# Altium schematic sheet 10 MCU_LINK_DEBUG.SchDoc
size 513 x 386 mm
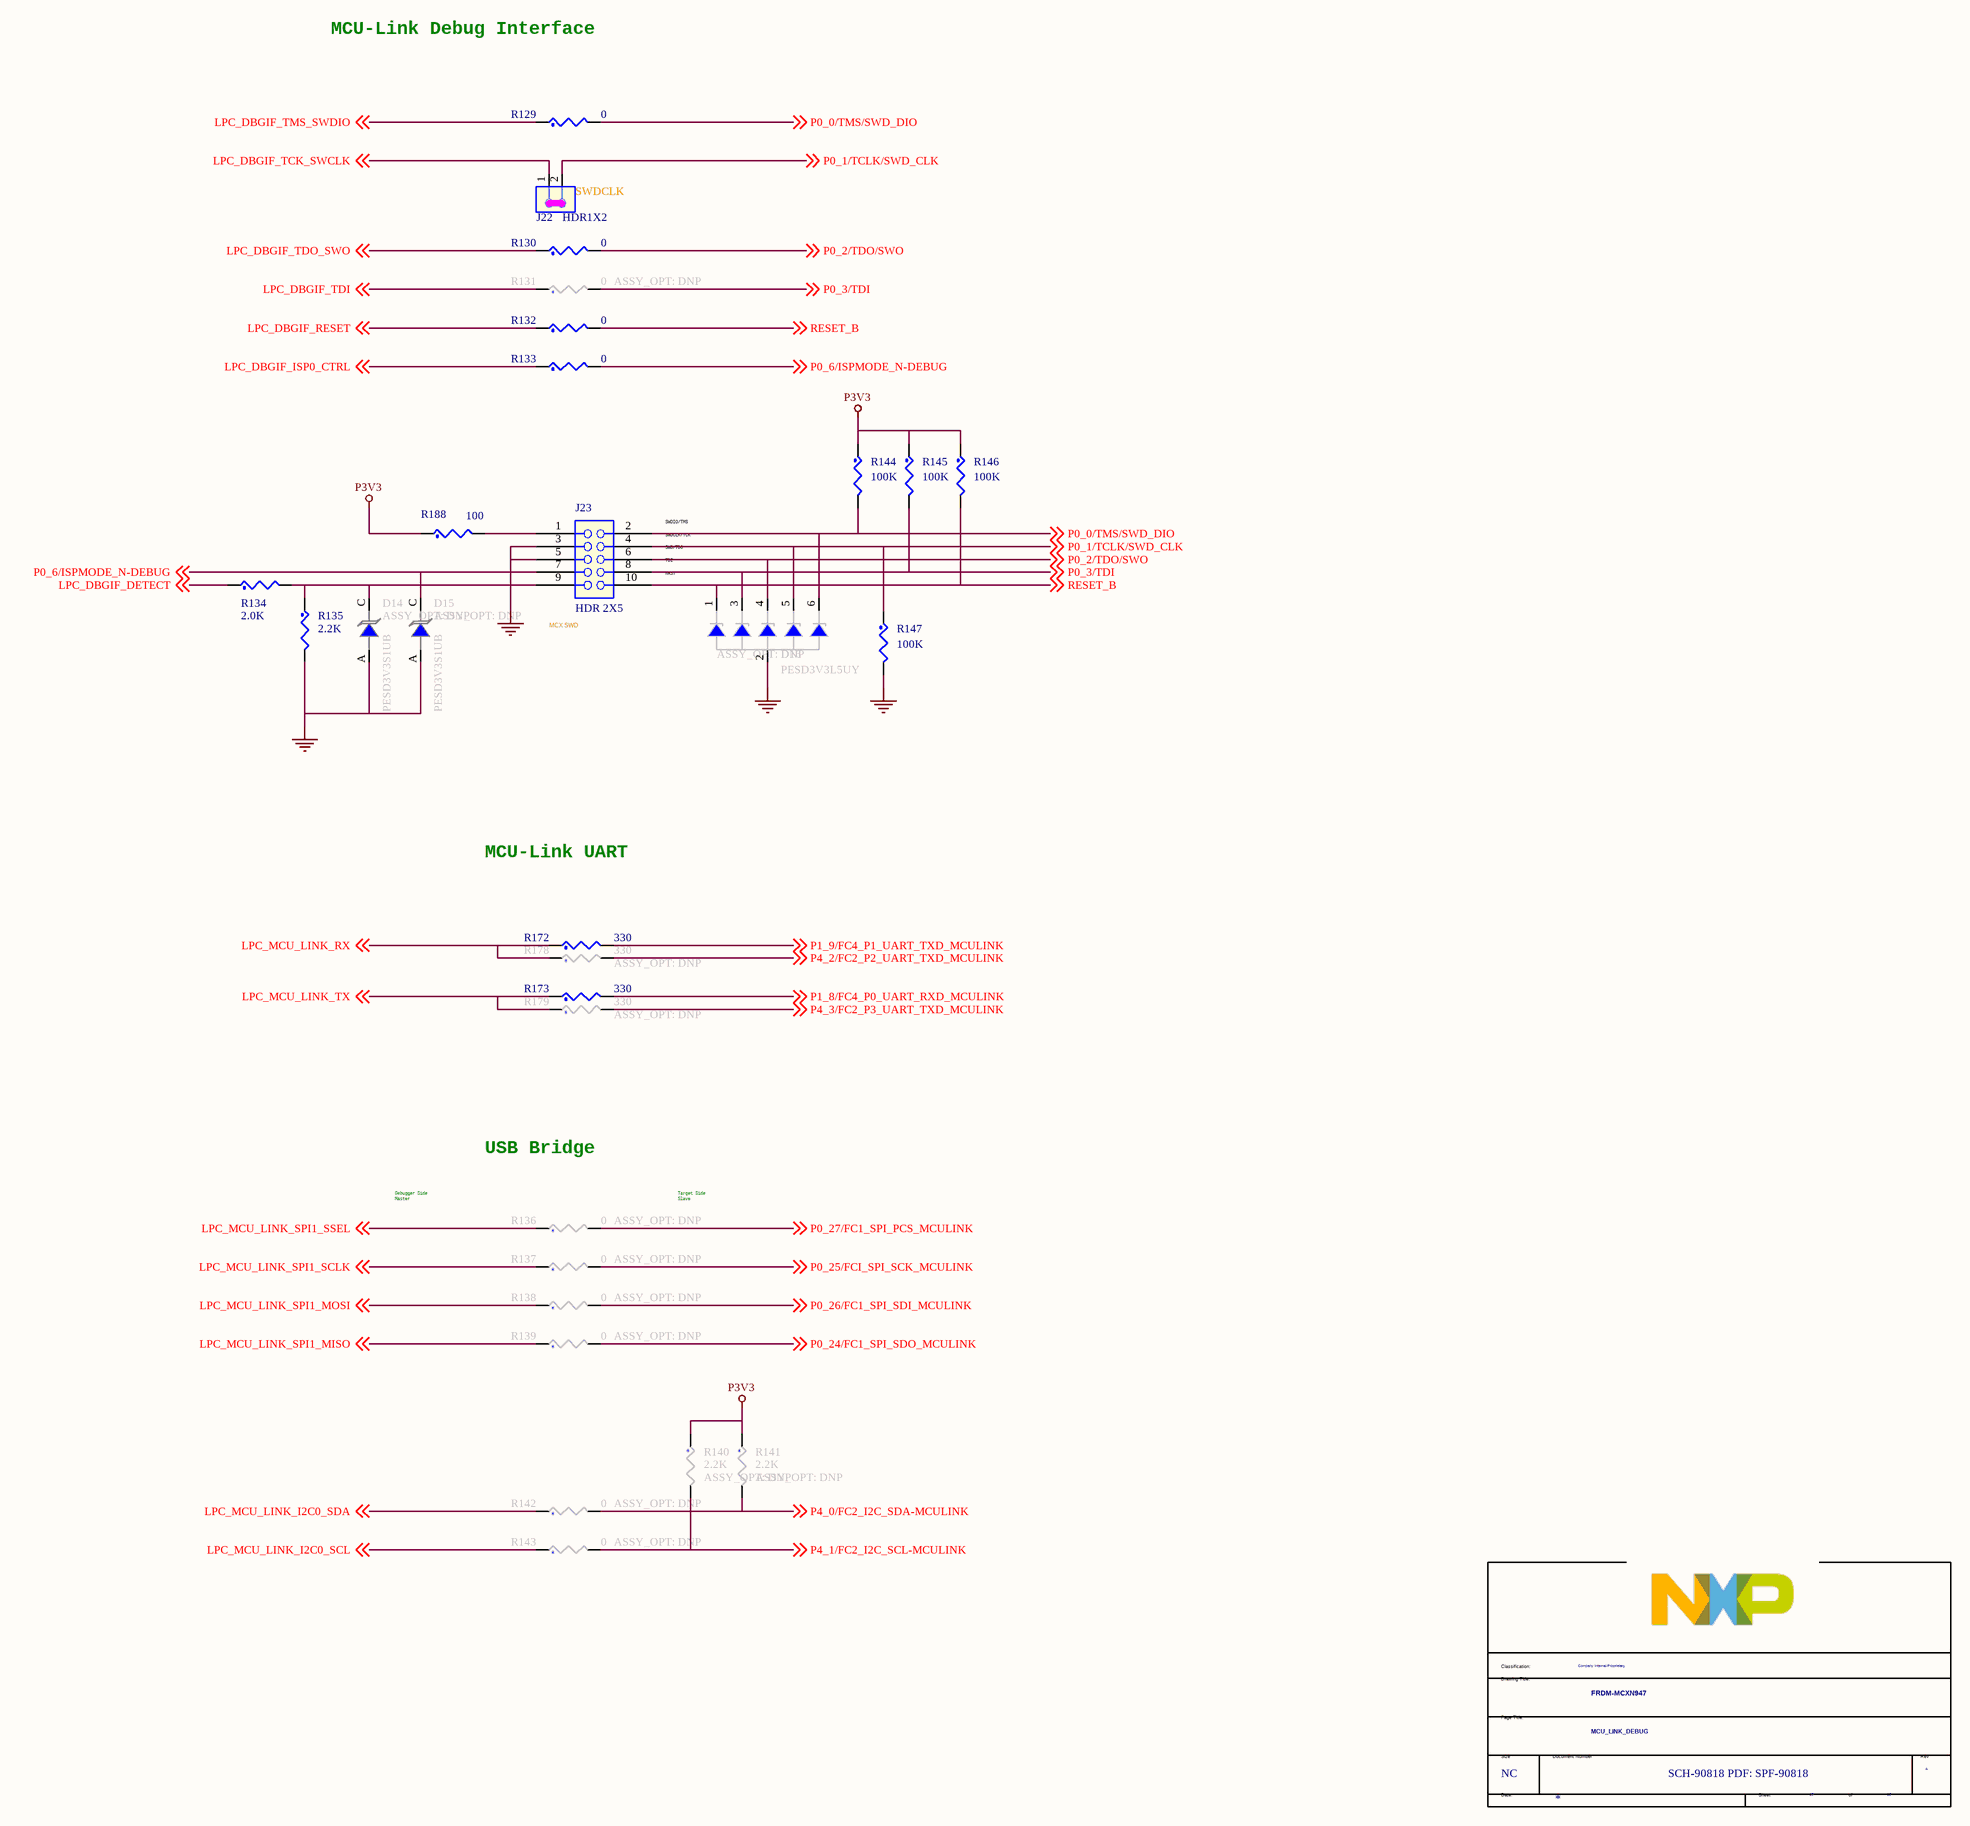
[diagram p0: 10 MCU_LINK_DEBUG.SchDoc]

## Parts
*  Doc: SCH-90818 PDF: SPF-90818  RevCode: A  Title: FRDM-MCXN947  Page Size: NC  Page Number: 10  Page Count: 13  PageTitle: MCU_LINK_DEBUG  Classification: Company Internal/Proprietary  (hidden comment: TitleBlock_FS)  (graphical)
D14  PESD3V3S1UB  ASSY_OPT: DNP  [sod523]
D15  PESD3V3S1UB  ASSY_OPT: DNP  [sod523]
D16  PESD3V3L5UY  ASSY_OPT: DNP  [sot-363_0p65_smt]
J22  HDR1X2  SILK: SWDCLK  [hdr1x2_5p48x2p69]
J23  HDR 2X5  SILK: MCX SWD  [hdr_5X2_ftsh_th]
R129  0  [RC0402_25]
R130  0  [RC0402_25]
R131  0  ASSY_OPT: DNP  [RC0402_25]
R132  0  [RC0402_25]
R133  0  [RC0402_25]
R134  2.0K  [RC0402_25]
R135  2.2K  [RC0402_25]
R136  0  ASSY_OPT: DNP  [RC0402_25]
R137  0  ASSY_OPT: DNP  [RC0402_25]
R138  0  ASSY_OPT: DNP  [RC0402_25]
R139  0  ASSY_OPT: DNP  [RC0402_25]
R140  2.2K  ASSY_OPT: DNP  [RC0402_25]
R141  2.2K  ASSY_OPT: DNP  [RC0402_25]
R142  0  ASSY_OPT: DNP  [RC0402_25]
R143  0  ASSY_OPT: DNP  [RC0402_25]
R144  100K  [RC0402_25]
R145  100K  [RC0402_25]
R146  100K  [RC0402_25]
R147  100K  [RC0402_25]
R172  330  [RC0603_OV]
R173  330  [RC0603_OV]
R178  330  ASSY_OPT: DNP  [RC0603_OV]
R179  330  ASSY_OPT: DNP  [RC0603_OV]
R188  100  [RC0402_25]

## Nets
GND: D14.A D15.A D16.2(A) J23.3(A2) J23.5(A3) R135.2 R147.2
P3V3: R140.1 R141.1 R144.1 R145.1 R146.1 R188.1
LPC_DBGIF_DETECT: R134.1 ; off-sheet LPC_DBGIF_DETECT
LPC_DBGIF_ISP0_CTRL: R133.1 ; off-sheet LPC_DBGIF_ISP0_CTRL
LPC_DBGIF_RESET: R132.1 ; off-sheet LPC_DBGIF_RESET
LPC_DBGIF_TCK_SWCLK: J22.1 ; off-sheet LPC_DBGIF_TCK_SWCLK
LPC_DBGIF_TDI: R131.1 ; off-sheet LPC_DBGIF_TDI
LPC_DBGIF_TDO_SWO: R130.1 ; off-sheet LPC_DBGIF_TDO_SWO
LPC_DBGIF_TMS_SWDIO: R129.1 ; off-sheet LPC_DBGIF_TMS_SWDIO
LPC_MCU_LINK_I2C0_SCL: R143.1 ; off-sheet LPC_MCU_LINK_I2C0_SCL
LPC_MCU_LINK_I2C0_SDA: R142.1 ; off-sheet LPC_MCU_LINK_I2C0_SDA
LPC_MCU_LINK_RX: R172.1 R178.1 ; off-sheet LPC_MCU_LINK_RX
LPC_MCU_LINK_SPI1_MISO: R139.1 ; off-sheet LPC_MCU_LINK_SPI1_MISO
LPC_MCU_LINK_SPI1_MOSI: R138.1 ; off-sheet LPC_MCU_LINK_SPI1_MOSI
LPC_MCU_LINK_SPI1_SCLK: R137.1 ; off-sheet LPC_MCU_LINK_SPI1_SCLK
LPC_MCU_LINK_SPI1_SSEL: R136.1 ; off-sheet LPC_MCU_LINK_SPI1_SSEL
LPC_MCU_LINK_TX: R173.1 R179.1 ; off-sheet LPC_MCU_LINK_TX
P0_0/TMS/SWD_DIO: D16.6(K5) J23.2(B1) R129.2 R144.2 ; off-sheet P0_0/TMS/SWD_DIO
P0_1/TCLK/SWD_CLK: D16.5(K4) J22.2 J23.4(B2) R147.1 ; off-sheet P0_1/TCLK/SWD_CLK
P0_2/TDO/SWO: D16.4(K3) J23.6(B3) R130.2 ; off-sheet P0_2/TDO/SWO
P0_3/TDI: D16.3(K2) J23.8(B4) R131.2 R145.2 ; off-sheet P0_3/TDI
P0_6/ISPMODE_N-DEBUG: D15.C J23.7(A4) R133.2 ; off-sheet P0_6/ISPMODE_N-DEBUG
P0_24/FC1_SPI_SDO_MCULINK: R139.2 ; off-sheet P0_24/FC1_SPI_SDO_MCULINK
P0_25/FCI_SPI_SCK_MCULINK: R137.2 ; off-sheet P0_25/FCI_SPI_SCK_MCULINK
P0_26/FC1_SPI_SDI_MCULINK: R138.2 ; off-sheet P0_26/FC1_SPI_SDI_MCULINK
P0_27/FC1_SPI_PCS_MCULINK: R136.2 ; off-sheet P0_27/FC1_SPI_PCS_MCULINK
P1_8/FC4_P0_UART_RXD_MCULINK: R173.2 ; off-sheet P1_8/FC4_P0_UART_RXD_MCULINK
P1_9/FC4_P1_UART_TXD_MCULINK: R172.2 ; off-sheet P1_9/FC4_P1_UART_TXD_MCULINK
P4_0/FC2_I2C_SDA-MCULINK: R141.2 R142.2 ; off-sheet P4_0/FC2_I2C_SDA-MCULINK
P4_1/FC2_I2C_SCL-MCULINK: R140.2 R143.2 ; off-sheet P4_1/FC2_I2C_SCL-MCULINK
P4_2/FC2_P2_UART_TXD_MCULINK: R178.2 ; off-sheet P4_2/FC2_P2_UART_TXD_MCULINK
P4_3/FC2_P3_UART_TXD_MCULINK: R179.2 ; off-sheet P4_3/FC2_P3_UART_TXD_MCULINK
RESET_B: D16.1(K1) J23.10(B5) R132.2 R146.2 ; off-sheet RESET_B
NetD14_C: D14.C J23.9(A5) R134.2 R135.1
NetJ23_1: J23.1(A1) R188.2

## Notes on the sheet
- MCU-Link Debug Interface
- SWDIO/TMS
- SWDCLK/TCK
- SWO/TDO
- TDI
- nRST
- MCU-Link UART
- Debugger Side
  Master
- USB Bridge
- Target Side
  Slave
- (in symbol TitleBlock_FS) Classification:; Drawing Title:; Page Title:; Size; Document Number; Rev; Date:; Sheet; of

## Library data of the parts
* = TitleBlock_FS: Classification: Public, Company Internal/Proprietary, Company Confidential,  Company Secret; Variant Name: <Core Design>; OrgAddr2: Austin, TX 78735-8598; OrgAddr1: 6501 William Cannon Drive West; OrgName: NXP Semiconductors; Page Create Date: March  8, 1995; Page Modify Date: *
D14 D15 = DIODE_TVS: DIODE TVS UNIDIR 3.3VWM 20VC SOD523; CLASS: IC; MFG_PN01: PESD3V3S1UB,115; MFG_NAME01: NEXPERIA; CAD_APPROVED: Yes; AGILE_PN: 480-79814; PCB Footprint: sod523; HEIGHT: 0.65MM
D16 = DIODE_ARRAY_5CH: DIODE TVS UNIDIR 3.3VWM 12VC SOT363; CLASS: IC; MFG_PN01: PESD3V3L5UY,115; MFG_NAME01: NEXPERIA; Temp Range: -65¡ãC ~ 150¡ãC; CAD_APPROVED: Yes; AGILE_PN: 480-79841; HEIGHT: 1.1MM; PCB Footprint: sot-363_0p65_smt
J22 = CONN_HDR_2X1: HDR 1X2 TH 100MIL SP 342H AU 118L; CLASS: IO; JUMPER(DEFAULT): 1-2; AGILE_PN: 210-80468; CAD_APPROVED: Yes; Temp Range: -40¡ãC to 105¡ãC; MFG_NAME01: WURTH ELEKTRONIK EISOS GMBH & CO. KG (ELECTRONIC & ELECTROMEHANICAL COMP); MFG_PN01: 61300211121; HEIGHT: 8.69MM; Package Type: TH; ROHS: Yes; 3D_Mechanical_Footprint_File: http://fcl.am.freescale.net/ALLEGRO/step/hdr1x2_5p48x2p69.STEP; PCB Footprint: hdr1x2_5p48x2p69
J23 = CONN_HDR_5X2: HDR 2X5 TH 50MIL CTR 167H AU 91L; CLASS: IO; MFG_PN01: 0922S0205011N6T-2LF; MFG_NAME01: ANYTRONIC CORPORATION LIMITED; CAD_APPROVED: Yes; FPLIST: hdr_5X2_ftsh_th,hdr_5X2_ftsh_th_nsp,hdr_5X2_ftsh_th_nsp_swd; AGILE_PN: 210-80192; ROHS: Yes; HEIGHT: 4.25MM; PCB Footprint: hdr_5X2_ftsh_th
R129-R131 R136-R139 R142 R143 = RES: RES MF ZERO OHM 1/16W 5% 0402; CLASS: DISCRETE; AGILE_PN: 470-75394; FPLIST: RC0402_25,RC0402_HD,RC0402_X2,0402_CC,rc0402_lamp3; CAD_APPROVED: Yes; MFG_NAME01: BOURNS; MFG_PN01: CR0402-J/-000GLF; PCB Footprint: RC0402_25; HEIGHT: 0.45 MM; Tolerance: 5%; ROHS: Yes
R132 R133 = RES: RES MF ZERO OHM 1/16W 5% 0402; CLASS: DISCRETE; MFG_PN01: CR0402-J/-000GLF; MFG_NAME01: BOURNS; CAD_APPROVED: Yes; FPLIST: RC0402_25,RC0402_HD,RC0402_X2,0402_CC,rc0402_lamp3; AGILE_PN: 470-75394; PCB Footprint: RC0402_25; ROHS: Yes; Tolerance: 5%; HEIGHT: 0.45 MM
R134 = RES: RES MF 2.0K 1/16W 1% 0402; CLASS: DISCRETE; AGILE_PN: 470-75356; FPLIST: RC0402_25,RC0402_HD,0402_CC,rc0402_ghwe; CAD_APPROVED: Yes; MFG_NAME01: BOURNS; MFG_PN01: CR0402-FX-2001GLF; PCB Footprint: RC0402_25; HEIGHT: 0.4mm; Tolerance: 1%; ROHS: Yes; 3D_Mechanical_Footprint_File: http://fcl.am.freescale.net/ALLEGRO/step/rc0402_25.STEP
R135 R141 = RES: RES MF 2.2K 1/16W 1% 0402; CLASS: DISCRETE; MFG_PN01: CR0402-FX-2201GLF; MFG_NAME01: Bourns Inc.; Temp Range: -55 ¡ãC to +155 ¡ãC; CAD_APPROVED: yes; FPLIST: RC0402_25,RC0402_HD,0402_CC; AGILE_PN: 470-83213; PCB Footprint: RC0402_25; 3D_Mechanical_Footprint_File: http://fcl.am.freescale.net/ALLEGRO/step/rc0402_25.STEP; ROHS: Yes; HEIGHT: 0.4 MM
R140 = RES: RES MF 2.2K 1/16W 1% 0402; CLASS: DISCRETE; AGILE_PN: 470-83213; FPLIST: RC0402_25,RC0402_HD,0402_CC; CAD_APPROVED: yes; Temp Range: -55 ¡ãC to +155 ¡ãC; MFG_NAME01: Bourns Inc.; MFG_PN01: CR0402-FX-2201GLF; PCB Footprint: RC0402_25; HEIGHT: 0.4 MM; ROHS: Yes; 3D_Mechanical_Footprint_File: http://fcl.am.freescale.net/ALLEGRO/step/rc0402_25.STEP
R144 R146 R147 = RES: RES MF 100K 1/16W 1% 0402; CLASS: DISCRETE; MFG_PN01: CR0402-FX-1003GLF; MFG_NAME01: BOURNS; CAD_APPROVED: Yes; FPLIST: RC0402_25,RC0402_HD,0402_CC; AGILE_PN: 470-76240; ROHS: Yes; Tolerance: 1%; HEIGHT: 0.4MM; PCB Footprint: RC0402_25
R145 = RES: RES MF 100K 1/16W 1% 0402; CLASS: DISCRETE; AGILE_PN: 470-76240; FPLIST: RC0402_25,RC0402_HD,0402_CC; CAD_APPROVED: Yes; MFG_NAME01: BOURNS; MFG_PN01: CR0402-FX-1003GLF; HEIGHT: 0.4MM; Tolerance: 1%; ROHS: Yes; PCB Footprint: RC0402_25
R172 R173 R179 = RES: RES MF 330 OHM 1/10W 5% 0603; CLASS: DISCRETE; AGILE_PN: 470-75451; FPLIST: RC0603_OV,RC0603,0603_CC; CAD_APPROVED: Yes; MFG_NAME01: BOURNS; MFG_PN01: CR0603-JW-331ELF; HEIGHT: 0.6MM; Tolerance: 5%; ROHS: Yes; PCB Footprint: RC0603_OV
R178 = RES: RES MF 330 OHM 1/10W 5% 0603; CLASS: DISCRETE; MFG_PN01: CR0603-JW-331ELF; MFG_NAME01: BOURNS; CAD_APPROVED: Yes; FPLIST: RC0603_OV,RC0603,0603_CC; AGILE_PN: 470-75451; ROHS: Yes; Tolerance: 5%; HEIGHT: 0.6MM; PCB Footprint: RC0603_OV
R188 = RES: RES MF 100 OHM 1/16W 5% 0402; CLASS: DISCRETE; MFG_PN01: CR0402-JW-101GLF; MFG_NAME01: BOURNS; CAD_APPROVED: Yes; FPLIST: RC0402_25,RC0402_HD,RC0402_X2,0402_CC; AGILE_PN: 470-75591; ROHS: Yes; Tolerance: 5%; HEIGHT: 0.45mm; PCB Footprint: RC0402_25